# EAGLE design POGO_DCDC v2 (EAGLE 9.6.2)
COMPANY: ADAFRUIT INDUSTRIES; DRAWN: KTOWN; REV: B
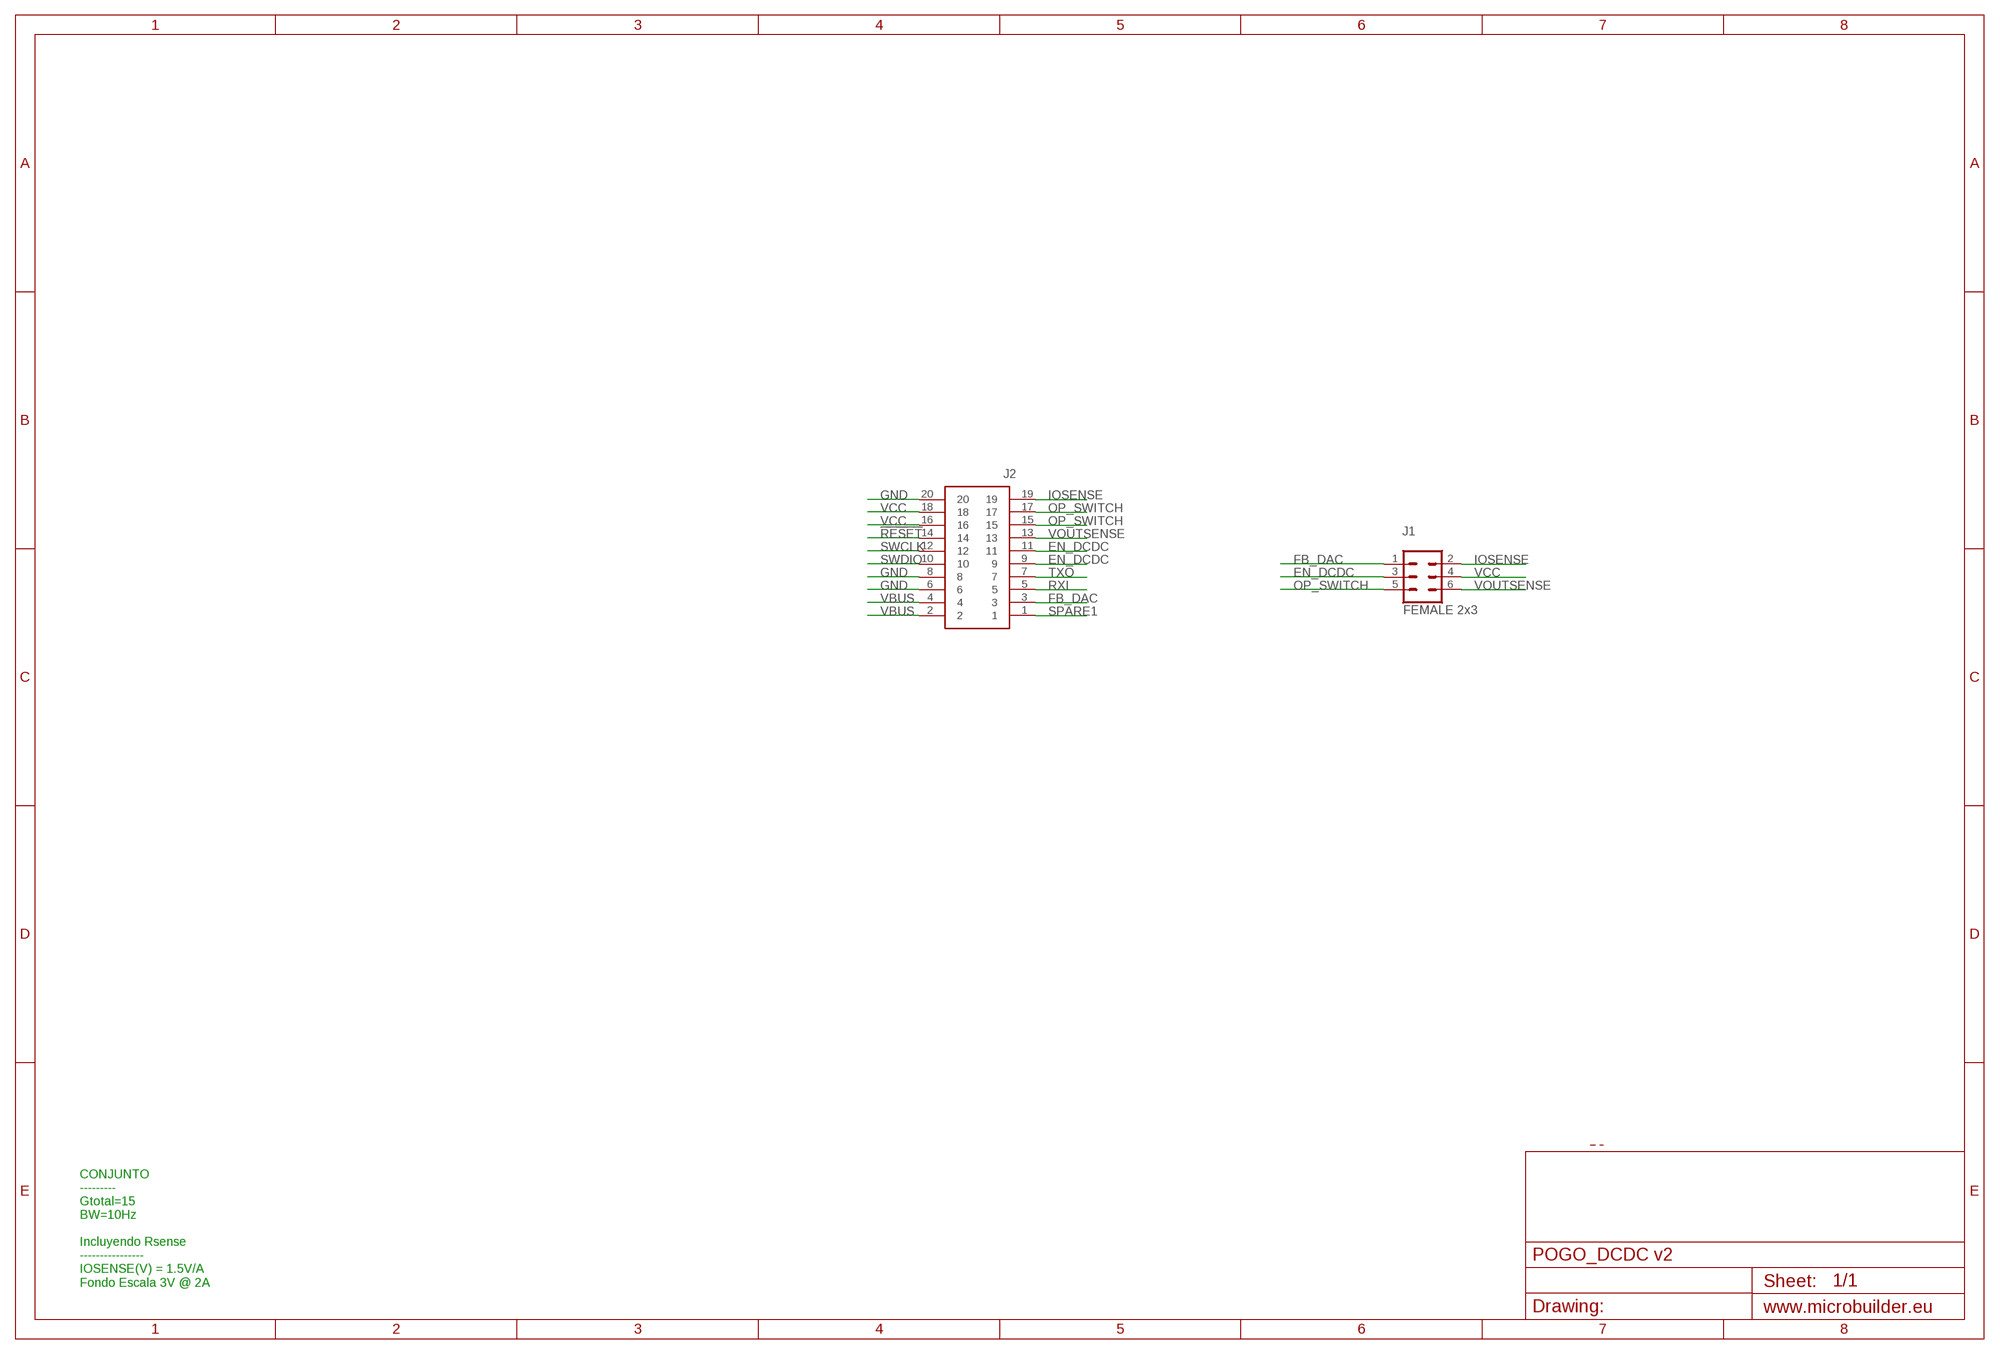
[diagram p0: schematic, sheet 1]

## Parts
J1  FEMALE 2x3  CONN_03X2FEMALE  [2X3]
J2  DF40C_2.0_-20DS-0.4V_51_  [DF40C2020DS04V51]

## Nets
!RESET: J2.14
EN_DCDC: J1.3 J2.9 J2.11
FB_DAC: J1.1 J2.3
GND: J2.6 J2.8 J2.20
IOSENSE: J1.2 J2.19
OP_SWITCH: J1.5 J2.15 J2.17
RXI: J2.5
SPARE1: J2.1
SWCLK: J2.12
SWDIO: J2.10
TXO: J2.7
VBUS: J2.2 J2.4
VCC: J1.4 J2.16 J2.18
VOUTSENSE: J1.6 J2.13

## Notes on the sheet
- CONJUNTO
  ---------
  Gtotal=15
  BW=10Hz
  
  Incluyendo Rsense
  ----------------
  IOSENSE(V) = 1.5V/A
  Fondo Escala 3V @ 2A

## Library data of the parts
J1 = SparkFun-Connectors:CONN_03X2: Multi connection point. Often used as Generic Header-pin footprint for 0.1 inch spaced/style header connections You can populate with any combo of single row headers, but if you'd like an exact match, check these: Header - 2x3 (Male, 0.1") <https://www.sparkfun.com/products/12807> (PRT-12807) Header - 2x3 (Female, 0.1") <https://www.sparkfun.com/products/13010> (PRT-13010) 2x3 Pin Shrouded Header <https://www.sparkfun.com/products/10877> (PRT-10877) On any of the 0.1 inch spaced packages, you can populate with these: Break Away Headers - Straight <https://www.sparkfun.com/products/116> (PRT-00116) Break Away Male Headers - Right Angle <https://www.sparkfun.com/products/553> (PRT-00553) Female Headers <https://www.sparkfun.com/products/115> (PRT-00115) Break Away Headers - Machine Pin <https://www.sparkfun.com/products/117> (PRT-00117) Break Away Female Headers - Swiss Machine Pin <https://www.sparkfun.com/products/743> (PRT-00743) Special note: the shrouded connector mates well with our 3x2 ribbon cables: Ribbon Crimp Connector - 6-pin (2x3, Female) <https://www.sparkfun.com/products/10651> (PRT-10651) Ribbon Cable - 6 wire (15ft) <https://www.sparkfun.com/products/10646> (PRT-10646); PROD_ID: CONN-11566
J2 = DF40C_2.0_-20DS-0.4V_51_:DF40C_2.0_-20DS-0.4V_51_: Board to Board & Mezzanine Connectors 20P 2-ROW RECEPT VERT SMT 2.0MM HGHT Source: Datasheet <https://www.hirose.com/product/document?clcode=CL0684-4003-3-51&productname=DF40C-60DP-0.4V(51)&series=DF40&documenttype=Catalog&lang=en&documentid=D31649_en>; DESCRIPTION: Board to Board & Mezzanine Connectors 20P 2-ROW RECEPT VERT SMT 2.0MM HGHT; HEIGHT: 2.1mm; MANUFACTURER_NAME: Hirose; MANUFACTURER_PART_NUMBER: DF40C(2.0)-20DS-0.4V(51); MOUSER_PART_NUMBER: 798-DF40C2020DS04V51; MOUSER_PRICE-STOCK: https://www.mouser.co.uk/ProductDetail/Hirose-Connector/DF40C2.0-20DS-0.4V51?qs=3aug5cyrIbdA5dYbMRd5pw%3D%3D

## Net classes
2 gnd: width 0.305 mm, drill 0.483 mm, clearance 0.203 mm

## Board
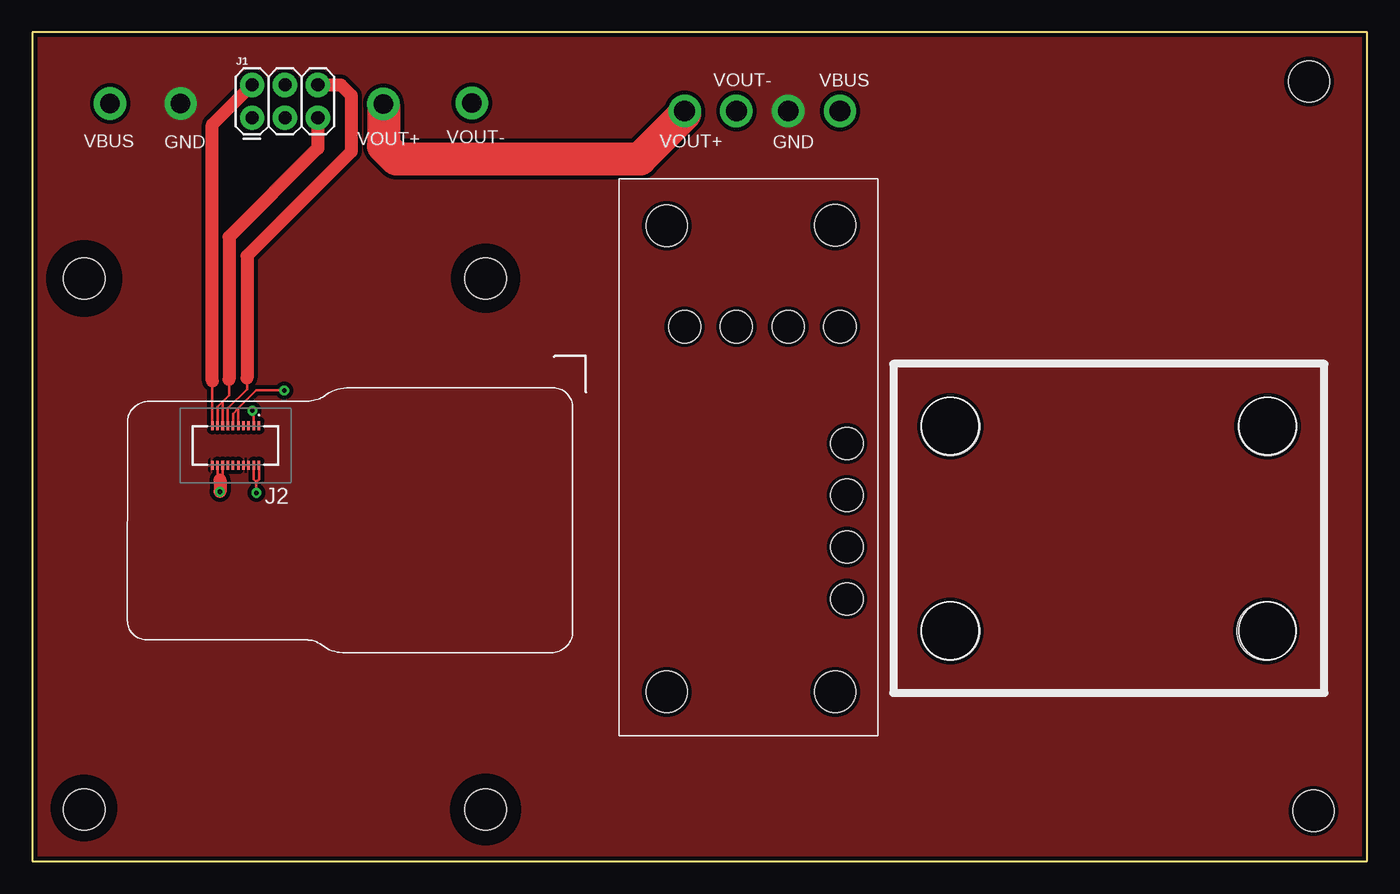
[diagram p1: board, top side]
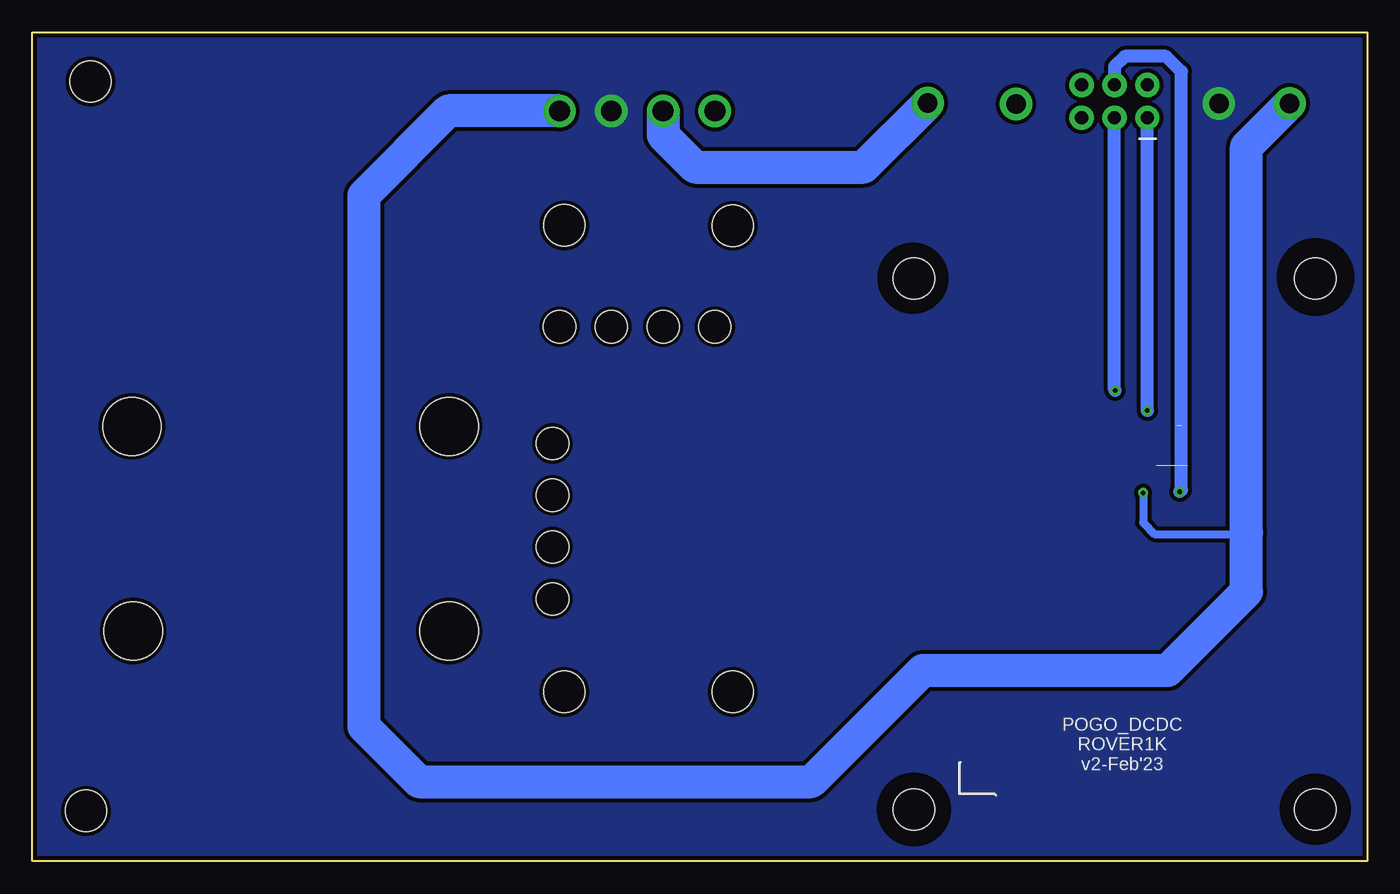
[diagram p2: board, bottom side, seen from below]

Size 103.1 x 64 mm. Coordinates in mm from the lower left corner, seen from the top.
Outline: 0,64 0,0 103.1,0 103.1,64 0,64
Copper layers (1*16): Top 0.035mm / dielectric 1.5mm / Bottom 0.035mm
Design rules "adafruit *": minimum track width 0.15mm, minimum drill 0.25mm, track to track 10mil, track to pad 10mil, pad to pad 10mil, via to via 10mil, smd to smd 5mil, copper to edge 8mil, drill to drill 8mil, minimum pad ring 10mil, minimum via ring 8mil, stop-mask expansion 2mil, vias tented up to drill 20mil, thermal gap 10mil
Holes 3.2 mm at 35,4 4,4 4,45 35,45 98.95,3.89 98.62,60.2 49.01,49.07 62.02,49.1 62.01,13.08 49,13.08
Holes 2.5 mm at 62.92,32.26 62.92,28.26 62.92,24.26 62.92,20.26 50.38,41.27 54.38,41.27 58.38,41.27 62.38,41.27
Holes 4.5 mm at 70.91,17.78 95.31,17.78 95.41,33.58 70.91,33.58
tRestrict: area 1.4,42.4 to 6.6,47.6; area 32.7,42.7 to 37.3,47.3; area 32.6,1.6 to 37.4,6.4; area 1.8,1.9 to 6.2,6.3
bRestrict: area 1.6,1.6 to 6.4,6.4; area 32.5,1.5 to 37.5,6.5; area 32.7,42.6 to 37.5,47.4; area 1.4,42.5 to 6.6,47.7

### Footprints (pad centres in the part's own frame; a part is rotated, then mirrored left to right if it is on the bottom)
2X3 = drill 1.016 pad 1.88: 1 0,0; 2 0,2.54; 3 2.54,0; 4 2.54,2.54; 5 5.08,0; 6 5.08,2.54
DF40C2020DS04V51 = smd 0.2 x 0.7: 1 -1.8,-1.54; 2 -1.8,1.54; 3 -1.4,-1.54; 4 -1.4,1.54; 5 -1,-1.54; 6 -1,1.54; 7 -0.6,-1.54; 8 -0.6,1.54; 9 -0.2,-1.54; 10 -0.2,1.54; 11 0.2,-1.54; 12 0.2,1.54; 13 0.6,-1.54; 14 0.6,1.54; 15 1,-1.54; 16 1,1.54; 17 1.4,-1.54; 18 1.4,1.54; 19 1.8,-1.54; 20 1.8,1.54

### Placement (x,y rotation side)
J1  16.97,57.4 0 top
J2  15.7,32.1 180 top

### Tracks (layer width: path | path; a pad name or v marks a point on that pad's centre or on a via)
EN_DCDC  (via drill 0.35)
  Top 0.203: J2.11 15.5,34.56 15.9,34.96 | v19.45,36.35 17.3,36.35 15.9,34.96 | J2.9 15.9,34.96
  Bottom 1.016: v19.45,36.35 19.51,36.41 J1.3
FB_DAC  (via drill 0.35)
  Top 0.203: J2.3 17.1,34.79 v17,34.79
  Bottom 1.016: v17,34.79 16.97,34.82 J1.1
GND  (via drill 1.5 pad 2.5, 1.6 pad 2.5)  (1 unrouted)
  other vias: 11.45,58.51 58.38,57.93
  pour Bottom (isolate 0.305): -1.24,65.23 -1.24,-4 105.12,-4 105.12,65.23
  pour Top (isolate 0.305): -1.6,65.3 -1.6,-4.4 105,-4.4 105,65.1 104.8,65.3
IOSENSE
  Top 0.203: J2.19 13.9,37.1
  Top 1.016: 13.9,37.1 13.9,56.87 J1.2
OP_SWITCH  (2 unrouted)
  Top 0.203: 15.2,37.2 15.2,35.98 14.7,35.48 J2.15 | J2.17 14.31,35.08 14.71,35.48
  Top 1.016: J1.5 22.05,55.05 15.2,48.2 15.2,37.2
VBUS  (via drill 0.35, 1.5 pad 2.5, 1.6 pad 2.5)
  Top 0.203: J2.4 17.1,29.5 17.3,29.3 | 17.3,29.3 17.5,29.5 J2.2 | 17.3,29.3 v17.3,28.45
  Bottom 0.61: v17.3,28.45 17.3,26.14 16.42,25.26 10.36,25.26 9.96,25.66 9.61,25.66 9.33,25.38
  Bottom 2.54: v62.38,57.93 70.97,57.93 77.5,51.4 77.5,10.41 73.23,6.14 42.93,6.14 34.33,14.74 15.41,14.74 9.33,20.82 9.33,25.38 9.33,55.18 v6.01,58.51
VCC  (via drill 0.35)
  Top 0.203: J2.16 14.7,29.64 14.49,29.43 14.3,29.62 J2.18
  Top 1.016: 14.49,29.43 v14.49,28.53
  Bottom 1.016: J1.4 19.51,61.37 18.73,62.15 15.53,62.15 14.34,60.96 14.34,28.68 v14.49,28.53
VOUT+  (via drill 1.5 pad 2.5, 1.6 pad 2.5)
  Top 2.54: v27.12,58.47 27.12,55.22 28.1,54.24 46.94,54.24 50.38,57.68 v50.38,57.93
VOUT-  (via drill 1.5 pad 2.5, 1.6 pad 2.5)
  Bottom 2.54: v54.38,57.93 54.38,56.07 51.91,53.6 38.89,53.6 v33.94,58.55
VOUTSENSE
  Top 0.203: 16.59,37.32 16.59,36.46 15.1,34.97 J2.13
  Top 1.016: J1.6 23.83,59.94 24.64,59.13 24.64,54.79 16.59,46.74 16.59,37.32

### Text on the board
tNames: VOUT- | VBUS | VOUT+ | VBUS | GND | VOUT+ | VOUT- | GND
bNames: POGO_DCDC / ROVER1K / v2-Feb'23